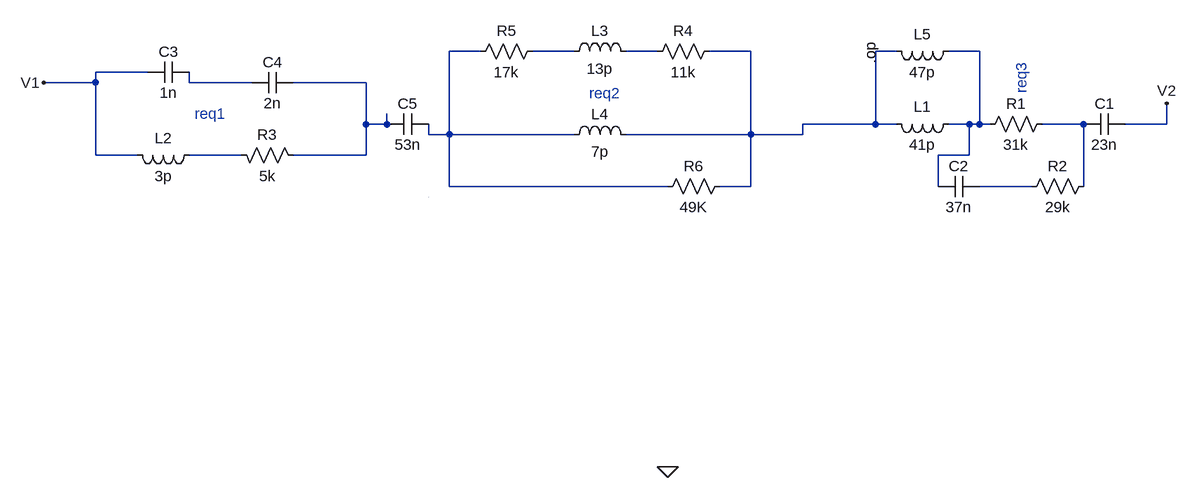
[diagram p0: schematic ejemplo 3.asc]
ejemplo 3.asc, the LTspice schematic file:
Version 4
SHEET 1 1168 680
WIRE 80 -224 32 -224
WIRE 224 -224 160 -224
WIRE 352 -224 304 -224
WIRE 496 -224 432 -224
WIRE 720 -224 688 -224
WIRE 848 -224 800 -224
WIRE -432 -192 -512 -192
WIRE -512 -176 -512 -192
WIRE -512 -176 -592 -176
WIRE -368 -176 -368 -192
WIRE -272 -176 -368 -176
WIRE -96 -176 -208 -176
WIRE -96 -112 -96 -176
WIRE -64 -112 -64 -128
WIRE -64 -112 -96 -112
WIRE 688 -112 688 -224
WIRE 688 -112 576 -112
WIRE 720 -112 688 -112
WIRE 832 -112 800 -112
WIRE 848 -112 848 -224
WIRE 848 -112 832 -112
WIRE 864 -112 848 -112
WIRE 1008 -112 944 -112
WIRE 1136 -112 1136 -144
WIRE 1136 -112 1072 -112
WIRE 0 -96 0 -112
WIRE 32 -96 32 -224
WIRE 32 -96 0 -96
WIRE 224 -96 32 -96
WIRE 496 -96 496 -224
WIRE 496 -96 304 -96
WIRE 576 -96 576 -112
WIRE 576 -96 496 -96
WIRE -512 -64 -512 -176
WIRE -448 -64 -512 -64
WIRE -288 -64 -368 -64
WIRE -96 -64 -96 -112
WIRE -96 -64 -208 -64
WIRE 832 -64 832 -112
WIRE 832 -64 784 -64
WIRE 32 -16 32 -96
WIRE 368 -16 32 -16
WIRE 496 -16 496 -96
WIRE 496 -16 448 -16
WIRE 784 -16 784 -64
WIRE 928 -16 848 -16
WIRE 1008 -16 1008 -112
WIRE 0 0 0 0
FLAG 368 416 0
FLAG -592 -176 V1
FLAG 1136 -144 V2
SYMBOL res 960 -128 R90
WINDOW 0 0 56 VBottom 2
WINDOW 3 32 56 VTop 2
SYMATTR InstName R1
SYMATTR Value 31k
SYMBOL res 1024 -32 R90
WINDOW 0 0 56 VBottom 2
WINDOW 3 32 56 VTop 2
SYMATTR InstName R2
SYMATTR Value 29k
SYMBOL res -192 -48 M270
WINDOW 0 32 56 VTop 2
WINDOW 3 0 56 VBottom 2
SYMATTR InstName R3
SYMATTR Value 5k
SYMBOL res 336 -208 R270
WINDOW 0 32 56 VTop 2
WINDOW 3 0 56 VBottom 2
SYMATTR InstName R4
SYMATTR Value 11k
SYMBOL res 64 -208 R270
WINDOW 0 32 56 VTop 2
WINDOW 3 0 56 VBottom 2
SYMATTR InstName R5
SYMATTR Value 17k
SYMBOL cap 1072 -128 R90
WINDOW 0 0 32 VBottom 2
WINDOW 3 32 32 VTop 2
SYMATTR InstName C1
SYMATTR Value 23n
SYMBOL cap 848 -32 R90
WINDOW 0 0 32 VBottom 2
WINDOW 3 32 32 VTop 2
SYMATTR InstName C2
SYMATTR Value 37n
SYMBOL cap -368 -176 M270
WINDOW 0 32 32 VTop 2
WINDOW 3 0 32 VBottom 2
SYMATTR InstName C3
SYMATTR Value 1n
SYMBOL cap -208 -192 R90
WINDOW 0 0 32 VBottom 2
WINDOW 3 32 32 VTop 2
SYMATTR InstName C4
SYMATTR Value 2n
SYMBOL ind 816 -128 R90
WINDOW 0 5 56 VBottom 2
WINDOW 3 32 56 VTop 2
SYMATTR InstName L1
SYMATTR Value 41p
SYMBOL ind -352 -80 R90
WINDOW 0 5 56 VBottom 2
WINDOW 3 32 56 VTop 2
SYMATTR InstName L2
SYMATTR Value 3p
SYMBOL ind 208 -208 R270
WINDOW 0 32 56 VTop 2
WINDOW 3 5 56 VBottom 2
SYMATTR InstName L3
SYMATTR Value 13p
SYMBOL ind 208 -80 R270
WINDOW 0 32 56 VTop 2
WINDOW 3 5 56 VBottom 2
SYMATTR InstName L4
SYMATTR Value 7p
SYMBOL cap 0 -128 R90
WINDOW 0 0 32 VBottom 2
WINDOW 3 32 32 VTop 2
SYMATTR InstName C5
SYMATTR Value 53n
SYMBOL res 464 -32 R90
WINDOW 0 0 56 VBottom 2
WINDOW 3 32 56 VTop 2
SYMATTR InstName R6
SYMATTR Value 49K
SYMBOL ind 816 -240 R90
WINDOW 0 5 56 VBottom 2
WINDOW 3 32 56 VTop 2
SYMATTR InstName L5
SYMATTR Value 47p
TEXT 680 -238 VRight 2 !.op
TEXT -360 -128 Left 2 ;req1
TEXT 296 -160 Right 2 ;req2
TEXT 912 -208 VRight 2 ;req3

The netlist it stands for:
* ejemplo 3.asc
R1 N008 N005 31k
R2 N008 N010 29k
R3 N007 N009 5k
R4 N003 N004 11k
R5 N001 N002 17k
C1 V2 N008 23n
C2 N010 N005 37n
C3 N006 V1 1n
C4 N007 N006 2n
L1 N005 N004 41p
L2 N009 V1 3p
L3 N002 N003 13p
L4 N001 N004 7p
C5 N001 N007 53n
R6 N004 N001 49K
L5 N005 N004 47p
.op
* req1
* req2
* req3
.backanno
.end